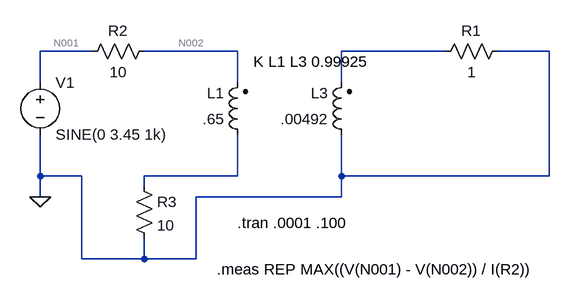
[diagram p0: schematic transformer_sim.asc]
transformer_sim.asc, the LTspice schematic file:
Version 4
SHEET 1 1064 680
WIRE 256 240 176 240
WIRE 480 240 336 240
WIRE 800 240 640 240
WIRE 960 240 880 240
WIRE 176 288 176 240
WIRE 480 288 480 240
WIRE 640 288 640 240
WIRE 176 432 176 368
WIRE 240 432 176 432
WIRE 480 432 480 368
WIRE 480 432 336 432
WIRE 640 432 640 368
WIRE 960 432 960 240
WIRE 960 432 640 432
WIRE 336 448 336 432
WIRE 176 464 176 432
WIRE 640 464 640 432
WIRE 640 464 416 464
WIRE 240 560 240 432
WIRE 336 560 336 528
WIRE 336 560 240 560
WIRE 416 560 416 464
WIRE 416 560 336 560
FLAG 176 464 0
SYMBOL Voltage 176 272 R0
SYMATTR InstName V1
SYMATTR Value SINE(0 3.45 1k)
SYMATTR SpiceLine Rser=0.000001
SYMBOL ind2 496 384 R180
WINDOW 0 36 80 Left 2
WINDOW 3 36 40 Left 2
SYMATTR InstName L1
SYMATTR Value .65
SYMATTR Type ind
SYMBOL ind2 656 384 R180
WINDOW 0 36 80 Left 2
WINDOW 3 36 40 Left 2
SYMATTR InstName L3
SYMATTR Value .00492
SYMATTR Type ind
SYMBOL Res 352 224 R90
WINDOW 0 0 56 VBottom 2
WINDOW 3 32 56 VTop 2
SYMATTR InstName R2
SYMATTR Value 10
SYMBOL Res 896 224 R90
WINDOW 0 0 56 VBottom 2
WINDOW 3 32 56 VTop 2
SYMATTR InstName R1
SYMATTR Value 1
SYMBOL res 320 432 R0
SYMATTR InstName R3
SYMATTR Value 10
TEXT 504 256 Left 2 !K L1 L3 0.99925
TEXT 480 504 Left 2 !.tran .0001 .100
TEXT 448 576 Left 2 !.meas REP MAX((V(N001) - V(N002)) / I(R2))

The netlist it stands for:
* transformer_sim.asc
V1 N001 0 SINE(0 3.45 1k) Rser=0.000001
L1 N004 N002 .65
L3 0 N003 .00492
R2 N002 N001 10
R1 0 N003 1
R3 N004 0 10
K L1 L3 0.99925
.tran .0001 .100
.meas REP MAX((V(N001) - V(N002)) / I(R2))
.backanno
.end